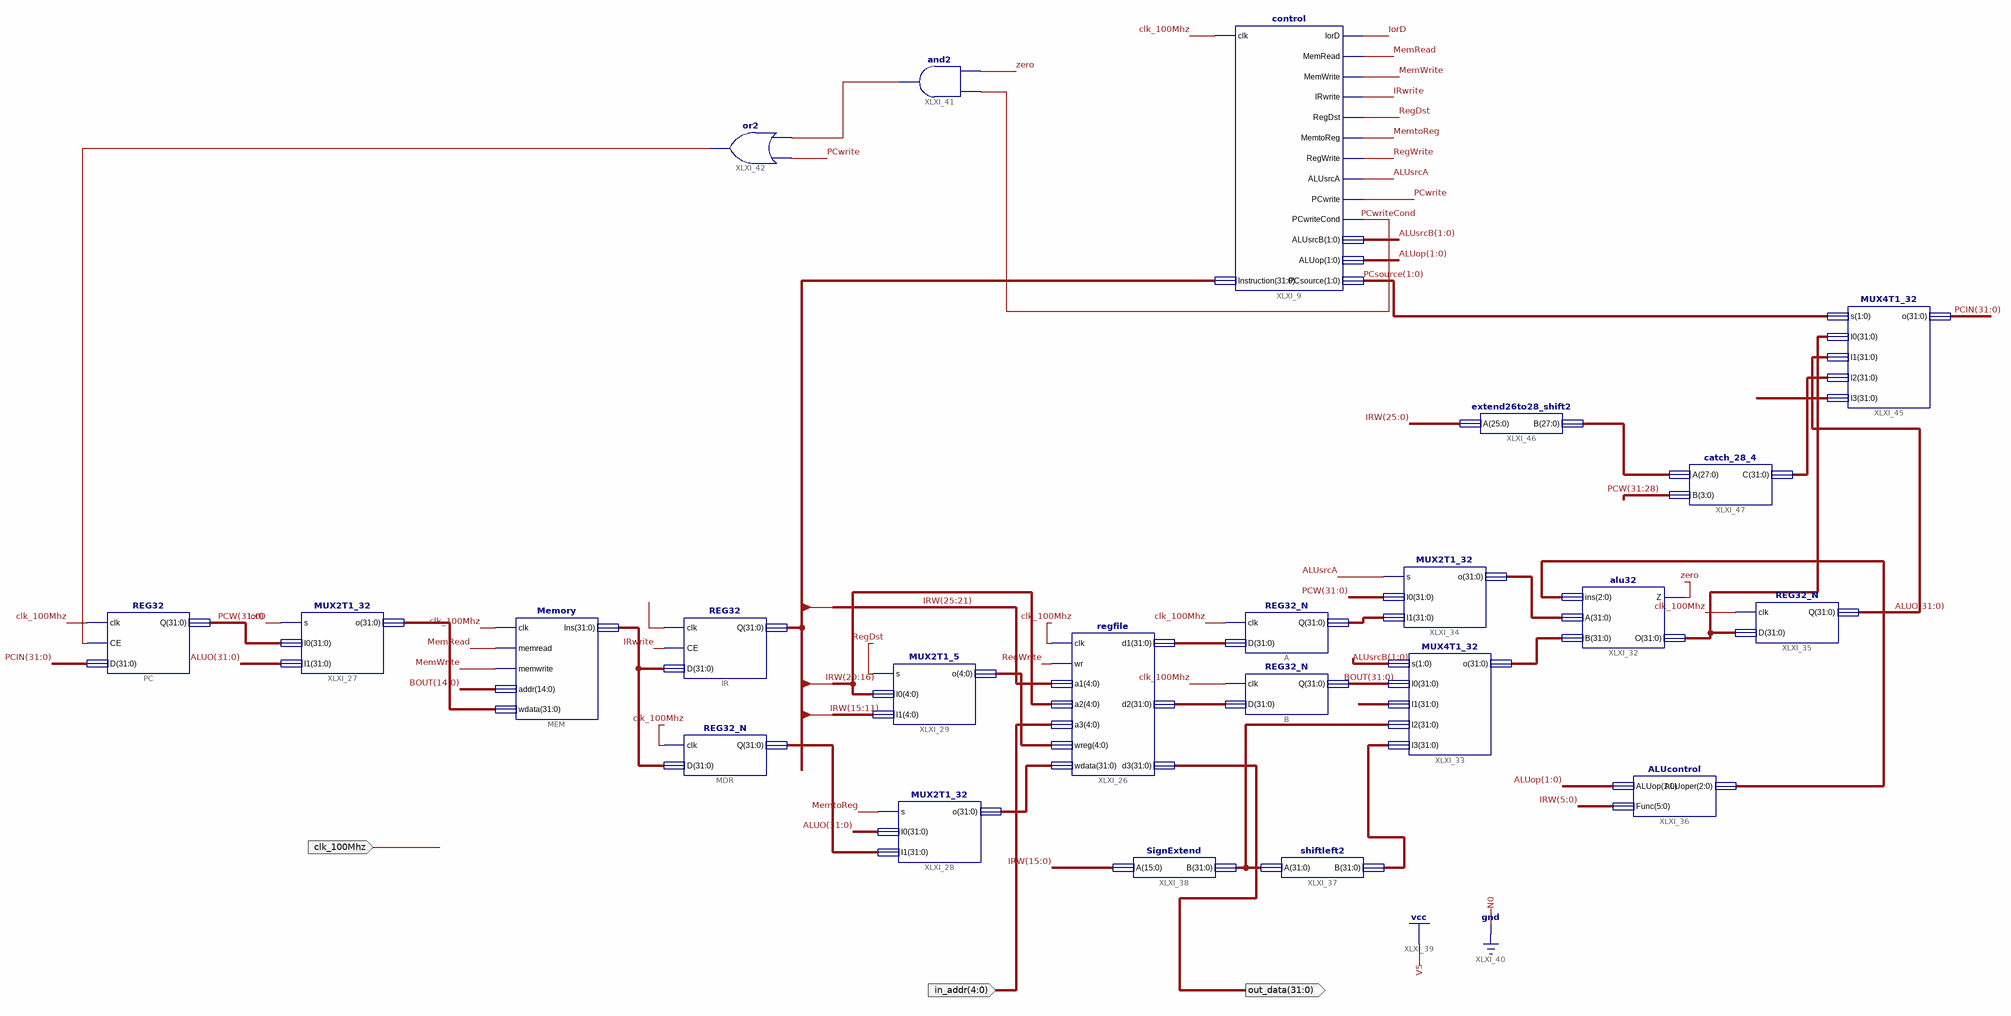
[diagram p0: schematic sheet 1]
// Xilinx ISE schematic Multiple_CPU_TOP.sch (kintex7) as structural Verilog: 23 symbols, 3 ports
module Multiple_CPU_TOP (
  input  [4:0] in_addr,
  input  clk_100Mhz,
  output [31:0] out_data
);

  wire ALUsrcA, IorD, IRwrite, MemRead, MemtoReg, MemWrite, PCwrite, PCwriteCond, RegDst, RegWrite, XLXN_78,
       XLXN_79, zero;
  wire [1:0] ALUop, ALUsrcB, PCsource;
  wire [2:0] XLXN_23;
  wire [4:0] XLXN_12;
  wire [27:0] XLXN_65;
  wire [31:0] ALUO, BOUT, IRW, PCIN, PCW, XLXN_2, XLXN_4, XLXN_10, XLXN_11, XLXN_15, XLXN_16, XLXN_18,
       XLXN_19, XLXN_20, XLXN_21, XLXN_24, XLXN_25, XLXN_67;

  Memory MEM (
    .clk(clk_100Mhz), .memread(MemRead), .memwrite(MemWrite), .addr(BOUT[14:0]), .wdata(XLXN_2), .Ins(XLXN_4));
  REG32 IR (.clk(clk_100Mhz), .CE(IRwrite), .D(XLXN_4), .Q(IRW));
  control XLXI_9 (
    .clk(clk_100Mhz), .Instruction(IRW), .IorD(IorD), .MemRead(MemRead), .MemWrite(MemWrite),
    .IRwrite(IRwrite), .RegDst(RegDst), .MemtoReg(MemtoReg), .RegWrite(RegWrite), .ALUsrcA(ALUsrcA),
    .PCwrite(PCwrite), .PCwriteCond(PCwriteCond), .ALUsrcB(ALUsrcB), .ALUop(ALUop), .PCsource(PCsource));
  REG32 PC (.clk(clk_100Mhz), .CE(XLXN_78), .D(PCIN), .Q(PCW));
  REG32_N MDR (.clk(clk_100Mhz), .D(XLXN_4), .Q(XLXN_10));
  regfile XLXI_26 (
    .clk(clk_100Mhz), .wr(RegWrite), .a1(IRW[25:21]), .a2(IRW[20:16]), .a3(in_addr), .wreg(XLXN_12),
    .wdata(XLXN_11), .d1(XLXN_15), .d2(XLXN_16), .d3(out_data));
  MUX2T1_32 XLXI_27 (.s(IorD), .I0(PCW), .I1(ALUO), .o(XLXN_2));
  MUX2T1_32 XLXI_28 (.s(MemtoReg), .I0(ALUO), .I1(XLXN_10), .o(XLXN_11));
  MUX2T1_5 XLXI_29 (.s(RegDst), .I0(IRW[20:16]), .I1(IRW[15:11]), .o(XLXN_12));
  REG32_N A (.clk(clk_100Mhz), .D(XLXN_15), .Q(XLXN_18));
  REG32_N B (.clk(clk_100Mhz), .D(XLXN_16), .Q(BOUT));
  alu32 XLXI_32 (.ins(XLXN_23), .A(XLXN_19), .B(XLXN_20), .Z(zero), .O(XLXN_21));
  MUX4T1_32 XLXI_33 (
    .s(ALUsrcB), .I0(BOUT), .I1(32'b00000000000000000000000000000100), .I2(XLXN_25), .I3(XLXN_24), .o(XLXN_20));
  MUX2T1_32 XLXI_34 (.s(ALUsrcA), .I0(PCW), .I1(XLXN_18), .o(XLXN_19));
  REG32_N XLXI_35 (.clk(clk_100Mhz), .D(XLXN_21), .Q(ALUO));
  ALUcontrol XLXI_36 (.ALUop(ALUop), .Func(IRW[5:0]), .ALUoper(XLXN_23));
  shiftleft2 XLXI_37 (.A(XLXN_25), .B(XLXN_24));
  SignExtend XLXI_38 (.A(IRW[15:0]), .B(XLXN_25));
  and XLXI_41 (XLXN_79, zero, PCwriteCond);
  or XLXI_42 (XLXN_78, XLXN_79, PCwrite);
  MUX4T1_32 XLXI_45 (.s(PCsource), .I0(XLXN_21), .I1(ALUO), .I2(XLXN_67), .I3({32{1'b0}}), .o(PCIN));
  extend26to28_shift2 XLXI_46 (.A(IRW[25:0]), .B(XLXN_65));
  catch_28_4 XLXI_47 (.A(XLXN_65), .B(PCW[31:28]), .C(XLXN_67));
endmodule
